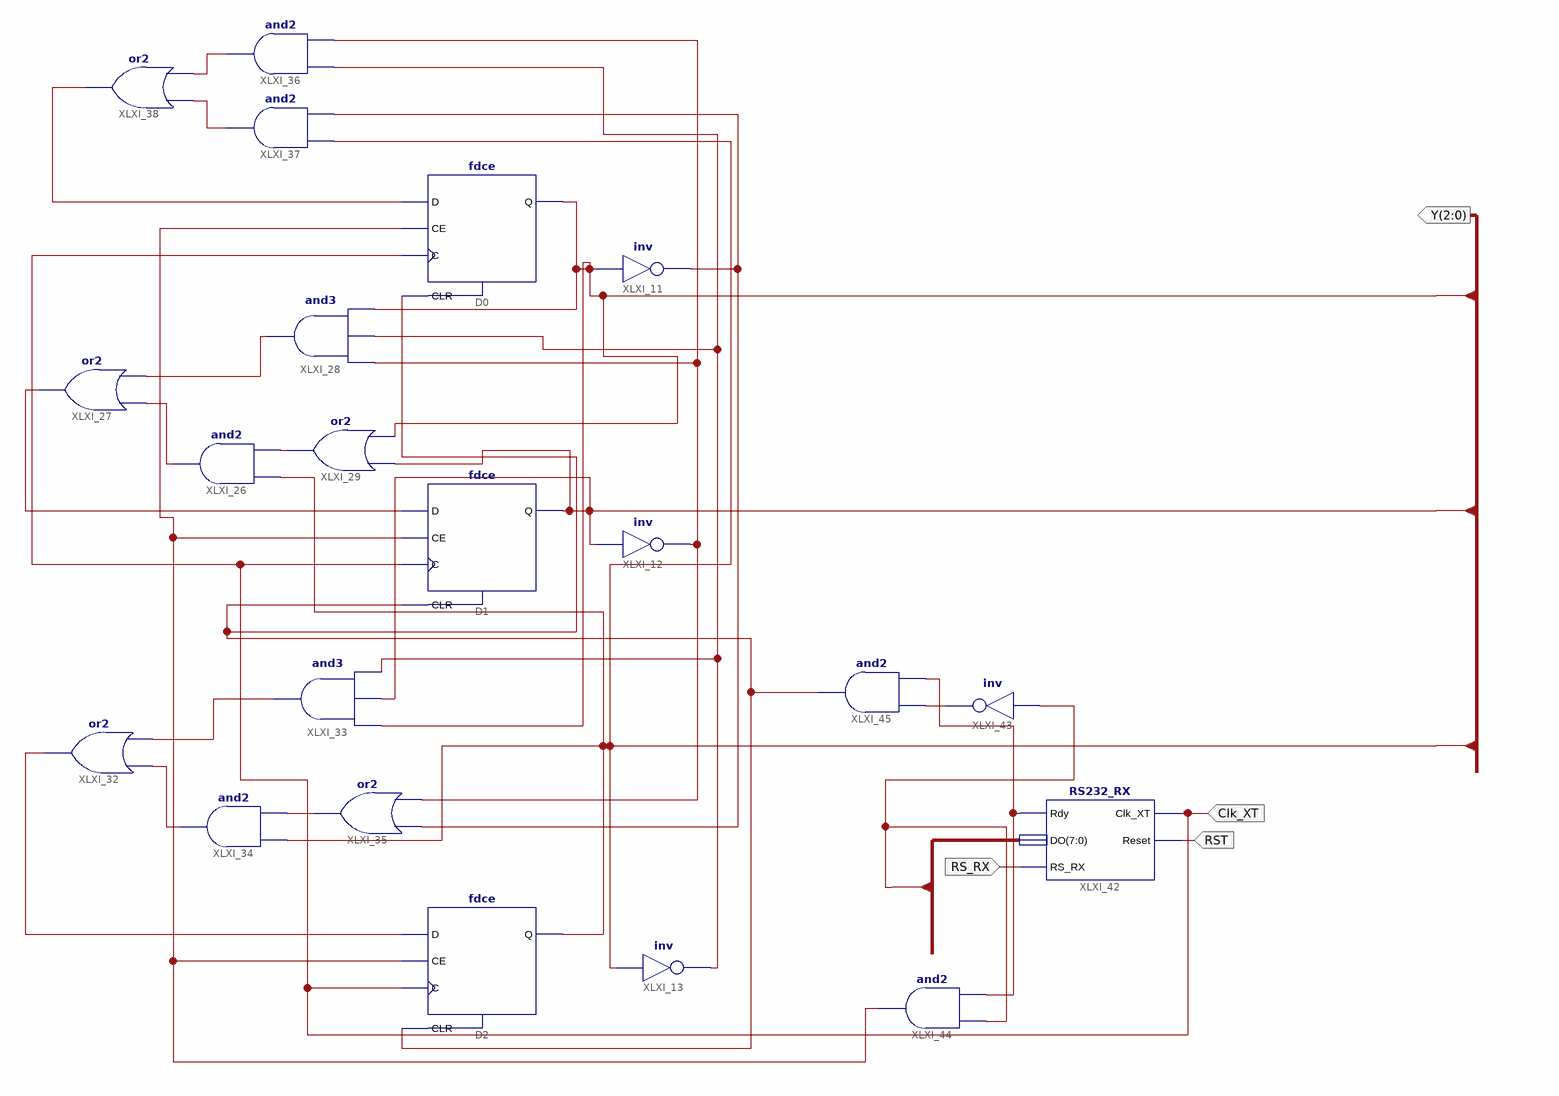
[diagram p0: schematic sheet 1]
// Xilinx ISE schematic zad1.sch (xc9500xl) as structural Verilog: 21 symbols, 4 ports
module zad1 (
  input  Clk_XT,
  input  RS_RX,
  input  RST,
  output [2:0] Y
);

  wire asdf, K7, XLXN_12, XLXN_41, XLXN_43, XLXN_44, XLXN_47, XLXN_48, XLXN_50, XLXN_51, XLXN_52, XLXN_56,
       XLXN_66, XLXN_68, XLXN_69, XLXN_70, XLXN_107, XLXN_108;
  wire [7:0] DD;

  fdce D1 (.C(Clk_XT), .CE(asdf), .CLR(K7), .D(XLXN_48), .Q(Y[1]));
  not XLXI_12 (XLXN_12, Y[1]);
  not XLXI_11 (XLXN_66, Y[0]);
  fdce D0 (.C(Clk_XT), .CE(asdf), .CLR(K7), .D(XLXN_70), .Q(Y[0]));
  and XLXI_26 (XLXN_44, XLXN_41, Y[2]);
  or XLXI_27 (XLXN_48, XLXN_43, XLXN_44);
  and XLXI_28 (XLXN_43, Y[0], XLXN_47, XLXN_12);
  or XLXI_29 (XLXN_41, Y[0], Y[1]);
  fdce D2 (.C(Clk_XT), .CE(asdf), .CLR(K7), .D(XLXN_56), .Q(Y[2]));
  not XLXI_13 (XLXN_47, Y[2]);
  or XLXI_32 (XLXN_56, XLXN_50, XLXN_51);
  and XLXI_33 (XLXN_50, XLXN_47, Y[1], Y[0]);
  and XLXI_34 (XLXN_51, XLXN_52, Y[2]);
  or XLXI_35 (XLXN_52, XLXN_12, XLXN_66);
  and XLXI_36 (XLXN_68, XLXN_12, XLXN_47);
  and XLXI_37 (XLXN_69, XLXN_66, Y[2]);
  or XLXI_38 (XLXN_70, XLXN_68, XLXN_69);
  RS232_RX XLXI_42 (.Reset(RST), .Clk_XT(Clk_XT), .Rdy(XLXN_108), .DO(DD), .RS_RX(RS_RX));
  not XLXI_43 (XLXN_107, DD[5]);
  and XLXI_44 (asdf, XLXN_108, DD[5]);
  and XLXI_45 (K7, XLXN_108, XLXN_107);
endmodule
